# EAGLE design DMX (EAGLE 5.10)
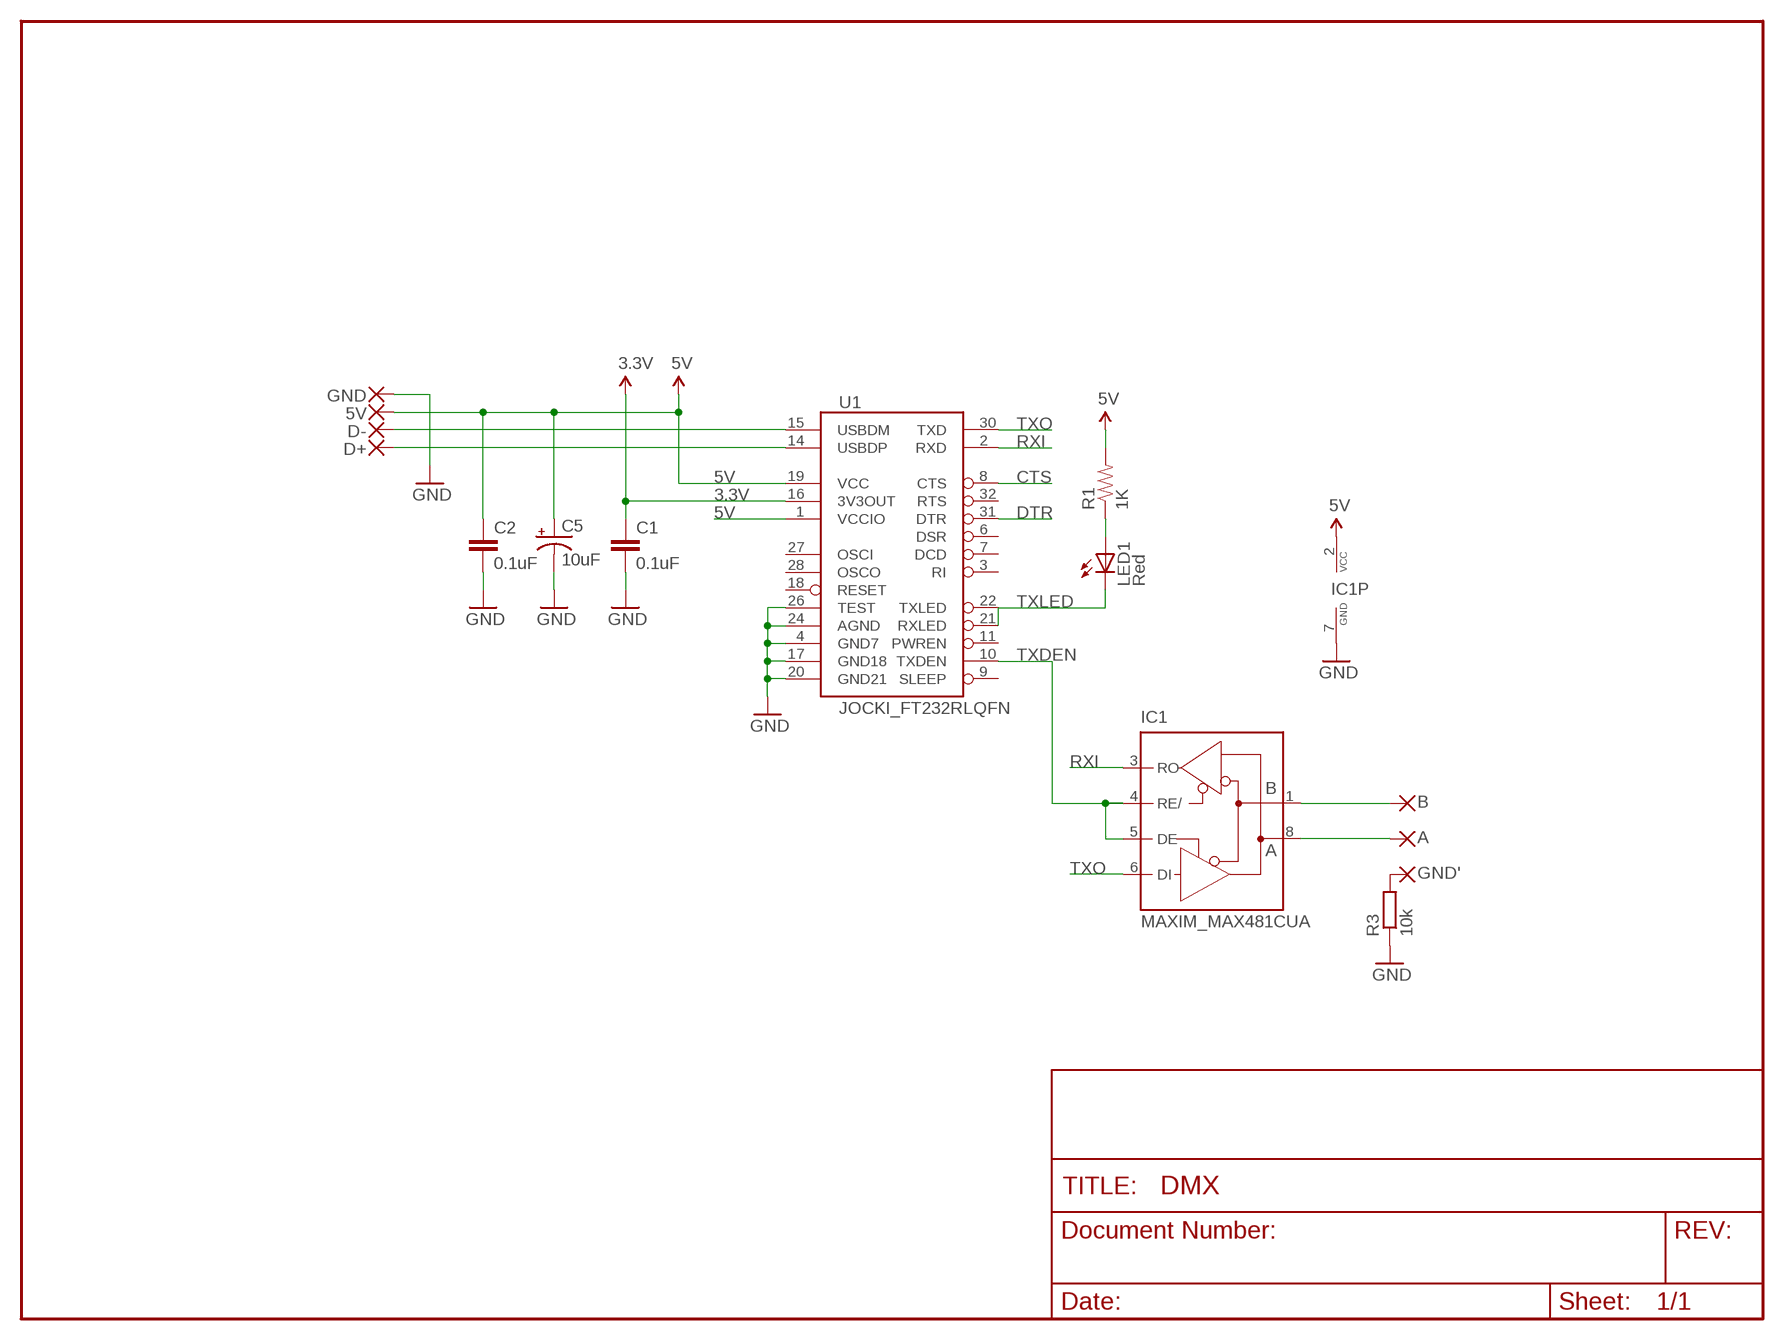
[diagram p0: schematic, sheet 1]

## Parts
5V  WIREPAD2,15/1,0  [2,15/1,0]
A  WIREPAD2,15/1,0  [2,15/1,0]
B  WIREPAD2,15/1,0  [2,15/1,0]
C1  0.1uF  CAP0603-CAP  [0603-CAP]
C2  0.1uF  CAP0603-CAP  [0603-CAP]
C5  10uF  CAP_POL1206  [EIA3216]
D+  WIREPAD2,15/1,0  [2,15/1,0]
D-  WIREPAD2,15/1,0  [2,15/1,0]
GND  WIREPAD2,15/1,0  [2,15/1,0]
GND'  WIREPAD2,15/1,0  [2,15/1,0]
IC1  MAXIM_MAX481CUA  [MAXIM_UMAX8]
LED1  Red  LED1206  [LED-1206]
R1  1K  RESISTOR0603-RES  [0603-RES]
R3  10k  R-EU_R0603  [R0603]
U1  JOCKI_FT232RLQFN  [JOCKI_RHB_S-PQFP-N32]

## Nets
3.3V [power]: C1.1 U1.16(3V3OUT)
5V: 5V.1(P) C2.1 C5.A(+) IC1.2(VCC) R1.2 U1.1(VCCIO) U1.19(VCC)
CTS: U1.8(CTS)
DTR: U1.31(DTR)
GND [power]: C1.2 C2.2 C5.C(-) GND.1(P) IC1.7(GND) R3.1 U1.4(GND7) U1.17(GND18) U1.20(GND21) U1.24(AGND) U1.26(TEST)
N$1: LED1.A R1.1
N$3: B.1(P) IC1.1(B)
N$4: A.1(P) IC1.8(A)
N$5: GND'.1(P) R3.2
RXI: IC1.3(RO) U1.2(RXD)
TXDEN: IC1.4(RE/) IC1.5(DE) U1.10(TXDEN)
TXLED: LED1.C U1.21(RXLED) U1.22(TXLED)
TXO: IC1.6(DI) U1.30(TXD)
USB_D+: D+.1(P) U1.14(USBDP)
USB_D-: D-.1(P) U1.15(USBDM)
Unconnected: U1.3(RI) U1.6(DSR) U1.7(DCD) U1.9(SLEEP) U1.11(PWREN) U1.18(RESET) U1.27(OSCI) U1.28(OSCO) U1.32(RTS)

## Library data of the parts
5V A B D+ D- GND GND' = wirepad:WIREPAD: Wire PAD connect wire on PCB
C1 C2 = SparkFun:CAP: Capacitor Standard 0603 ceramic capacitor, and 0.1" leaded capacitor.
C5 = SparkFun:CAP_POL: Capacitor Polarized These are standard SMD and PTH capacitors. Normally 10uF, 47uF, and 100uF in electrolytic and tantalum varieties. Always verify the external diameter of the through hole cap, it varies with capacity, voltage, and manufacturer. The EIA devices should be standard.
IC1 = DMX:MAXIM_MAX481CUA: RS485 TRANSEIVER
LED1 = SparkFun:LED: LEDs Standard schematic elements and footprints for 5mm, 3mm, 1206, and 0603 sized LEDs. 5mm - Spark Fun Electronics SKU : COM-00529 (and others)
R1 = SparkFun:RESISTOR: Resistor Basic schematic elements and footprints for 0603, 1206, and PTH resistors.
R3 = rcl:R-EU_: RESISTOR, European symbol
U1 = DMX:JOCKI_FT232RL: USB UART FT232RL 4th Generation USB UART (USB <-> Serial) Controller. Spark Fun Electronics SKU : COM-00650

## Net classes
0 default: width 0.203 mm
1 power: width 0.254 mm

## Board
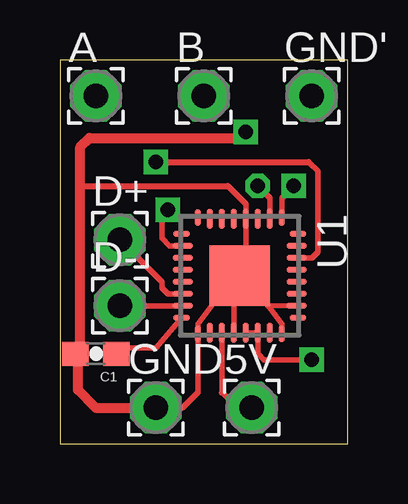
[diagram p1: board, top side]
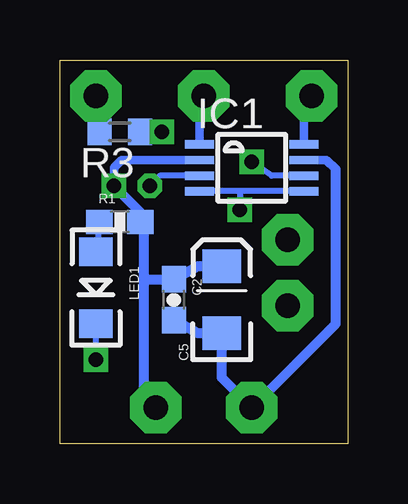
[diagram p2: board, bottom side, seen from below]

Size 12 x 16 mm. Coordinates in mm from the lower left corner, seen from the top.
Outline: 0,0 12,0 12,16 0,16 0,0
Copper layers (1*16): Top 0.035mm / dielectric 1.5mm / Bottom 0.035mm
Design rules "default": minimum track width 10mil, minimum drill 24mil, track to track 8mil, track to pad 8mil, pad to pad 8mil, via to via 8mil, smd to smd 8mil, copper to edge 40mil, drill to drill 8mil, minimum pad ring 10mil, minimum via ring 8mil, stop-mask expansion 4mil, vias tented up to drill 0mil, thermal gap 10mil

### Footprints (pad centres in the part's own frame; a part is rotated, then mirrored left to right if it is on the bottom)
2,15/1,0 = drill 1.016 pad 2.159 octagon: 1 0,0
0603-CAP = smd 1.1 x 1: 1 -0.85,0; 2 0.85,0
EIA3216 = smd 1.4 x 1.6: A 1.4,0; C -1.4,0
MAXIM_UMAX8 = smd 0.35 x 1.2: 1 -0.975,-2.175; 2 -0.325,-2.175; 3 0.325,-2.175; 4 0.975,-2.175; 5 0.975,2.175; 6 0.325,2.175; 7 -0.325,2.175; 8 -0.975,2.175
LED-1206 = smd 1.2 x 1.4: A -1.5,0; C 1.5,0
0603-RES = smd 1.1 x 1: 1 -0.85,0; 2 0.85,0
R0603 = smd 1 x 1.1: 1 -0.85,0; 2 0.85,0
JOCKI_RHB_S-PQFP-N32 = smd 0.7 x 0.229: 1 -2.425,1.75; 8 -2.425,-1.75; 17 2.425,-1.75; 24 2.425,1.75 | smd 0.85 x 0.229: 2 -2.375,1.25; 3 -2.375,0.75; 4 -2.375,0.25; 5 -2.375,-0.25; 6 -2.375,-0.75; 7 -2.375,-1.25; 18 2.375,-1.25; 19 2.375,-0.75; 20 2.375,-0.25; 21 2.375,0.25; 22 2.375,0.75; 23 2.375,1.25 | smd 0.229 x 0.7: 9 -1.75,-2.425; 16 1.75,-2.425; 25 1.75,2.425; 32 -1.75,2.425 | smd 0.229 x 0.85: 10 -1.25,-2.375; 11 -0.75,-2.375; 12 -0.25,-2.375; 13 0.25,-2.375; 14 0.75,-2.375; 15 1.25,-2.375; 26 1.25,2.375; 27 0.75,2.375; 28 0.25,2.375; 29 -0.25,2.375; 30 -0.75,2.375; 31 -1.25,2.375 | smd 2.54 x 2.54: EXP 0,0

### Placement (x,y rotation side)
5V  8,1.5 0 top
A  1.5,14.5 0 top
B  6,14.5 0 top
C1  1.5,3.75 180 top
C2  7.25,6 270 bottom
C5  5.25,6 90 bottom
D+  2.5,8.5 0 top
D-  2.5,5.75 0 top
GND  4,1.5 0 top
GND'  10.5,14.5 0 top
IC1  4,11.5 270 bottom
LED1  10.5,6.5 270 bottom
R1  9.5,9.25 0 bottom
R3  9.5,13 180 bottom
U1  7.5,7 270 top

### Tracks (layer width: path | path; a pad name or v marks a point on that pad's centre or on a via)
3.3V
  Top 0.229: 2.25,4 4,4 U1.16
  Top 0.254: C1.1 2.15,3.9 2.25,4
5V  (via drill 0.6)
  Top 0.229: 6.75,2.13 U1.19 | U1.1 9.25,10.25 v9.75,10.75
  Top 0.254: 6.75,2.13 7.38,1.5 5V.1
  Bottom 0.254: 8.5,9.5 R1.2
  Bottom 0.35: IC1.2 9.43,11.82 9.75,11.51 v9.75,10.75
  Bottom 0.406: 5V.1 8.5,2 8.5,7 | 8.5,7 8.5,7.5 8.5,9.5 v9.75,10.75 | C5.A 6.25,7.4 C2.1 8.35,6.85 8.5,7
GND  (via drill 0.6)
  Top 0.229: 6.5,6 5.75,5 U1.17 5.75,2.13 | 7.25,6 U1.20 | U1.24 9.25,5 8.68,5.76 U1.26 | 7,10.75 7.75,10 U1.4 7.75,6
  Top 0.254: 6.5,6 7.25,6 7.75,6 8.5,6 8.68,5.76 | 5.75,2.13 5.12,1.5 GND.1 | 0.85,10.75 7,10.75
  Top 0.406: GND.1 1.49,1.5 0.75,2.23 0.75,3.5 C1.2 0.75,3.75 0.85,4 0.85,10.75 0.85,12.37 1.24,12.75 7.5,12.75 v7.75,13
  Bottom 0.35: IC1.7 0.89,11.82 0.5,11.44
  Bottom 0.406: 0.5,11.44 0.5,5 GND.1 5.25,2.75 C5.C 6.25,4.6 C2.2 | v7.75,13 R3.1
N$1
  Bottom 0.254: R1.1 LED1.A
N$3
  Bottom 0.35: IC1.1 6.17,14.32 B.1
N$4
  Bottom 0.35: IC1.8 1.82,14.18 A.1
N$5
  Bottom 0.254: R3.2 GND'.1
RXI  (via drill 0.6)
  Top 0.229: U1.2 8.75,10.25 v8.25,10.75
  Bottom 0.254: v8.25,10.75 7.83,11.18 IC1.3
TXDEN  (via drill 0.6)
  Top 0.229: U1.10 4.57,8.25 4.25,8.57 4.25,9.5 v4.5,9.75
  Bottom 0.254: 4.5,10.53 v4.5,9.75 | 4.5,10.53 IC1.4 | IC1.5 4.5,10.53
TXLED  (via drill 0.6)
  Top 0.229: U1.21 U1.22 8.25,3.75 8.5,3.5 v10.5,3.5
  Bottom 0.254: v10.5,3.5 LED1.C
TXO  (via drill 0.6)
  Top 0.229: U1.30 10.5,7.75 10.75,8 10.75,11.37
  Top 0.254: v4,11.75 10.37,11.75 10.75,11.37
  Bottom 0.254: IC1.6 3.17,11.18 v4,11.75
USB_D+
  Top 0.229: U1.14 4.5,6.25 4.25,6.5 4.25,6.75 D+.1
USB_D-
  Top 0.229: D-.1 U1.15